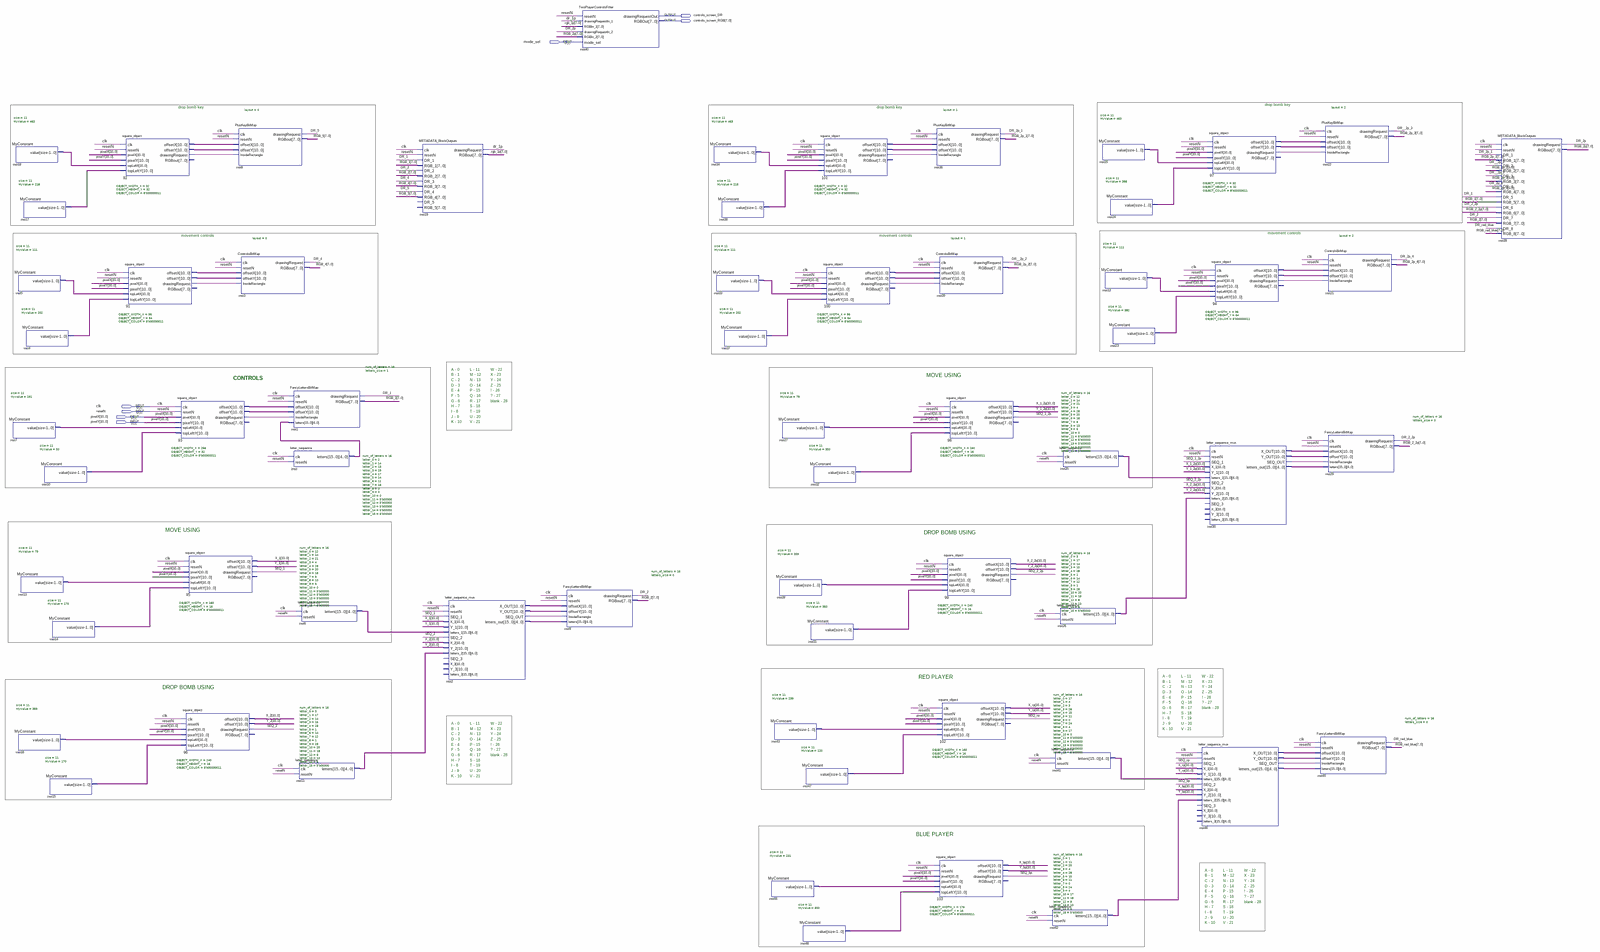
[diagram p0: schematic sheet, whole]
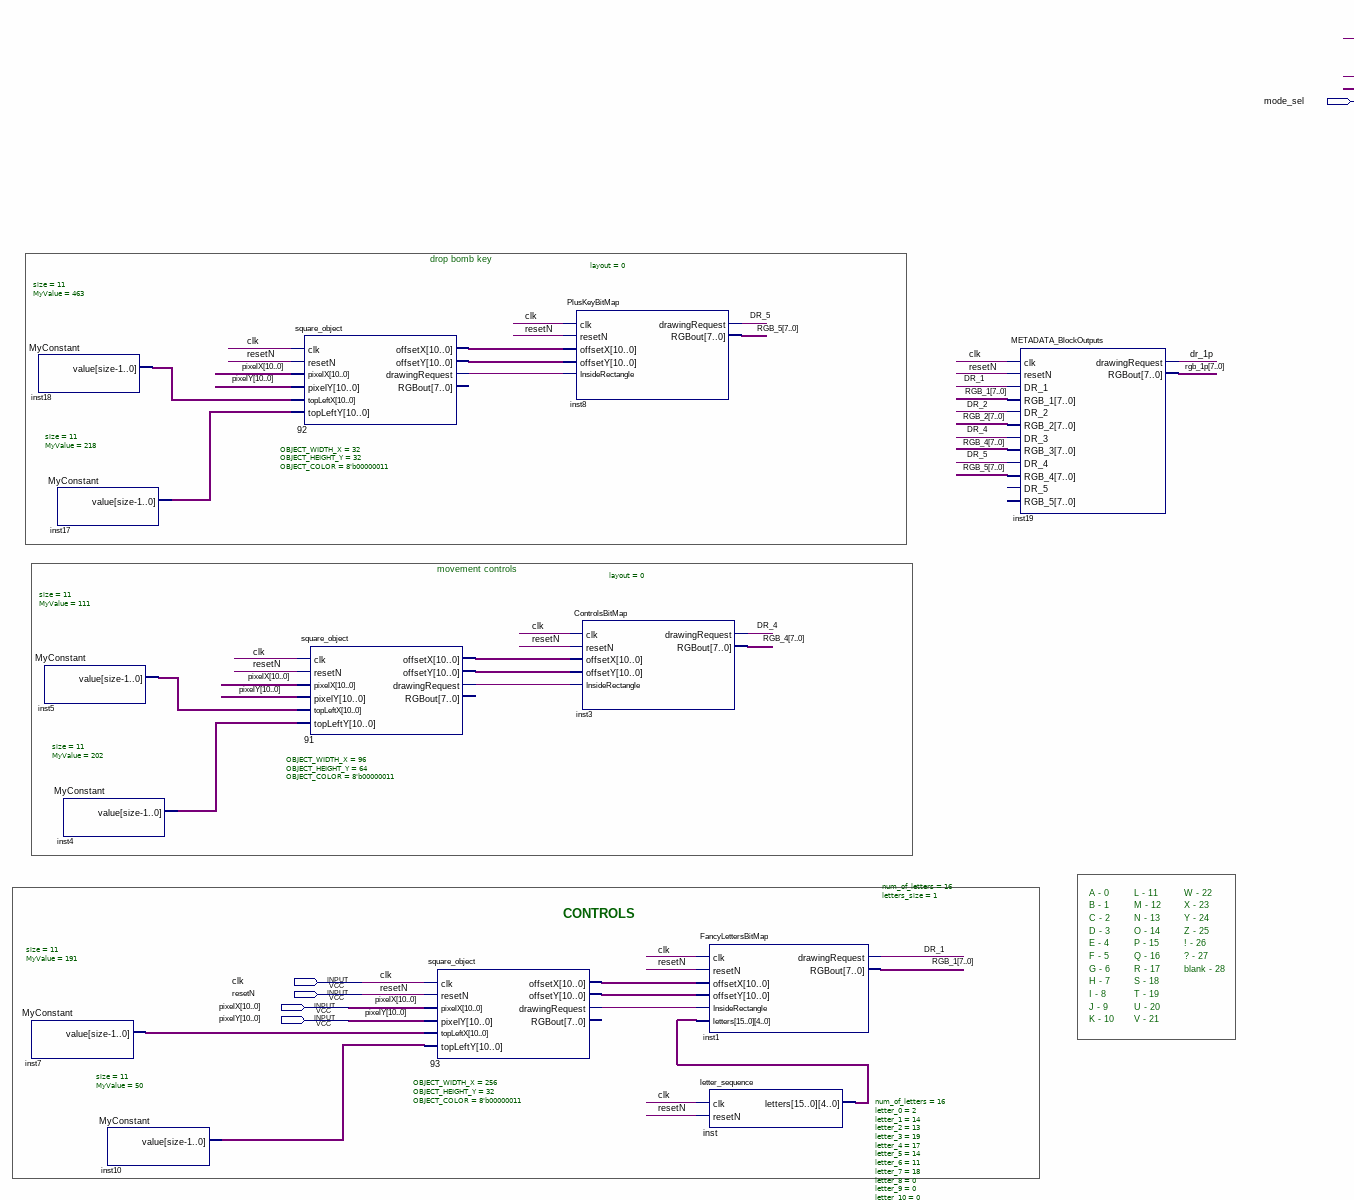
[diagram p1: schematic sheet, upper left part]
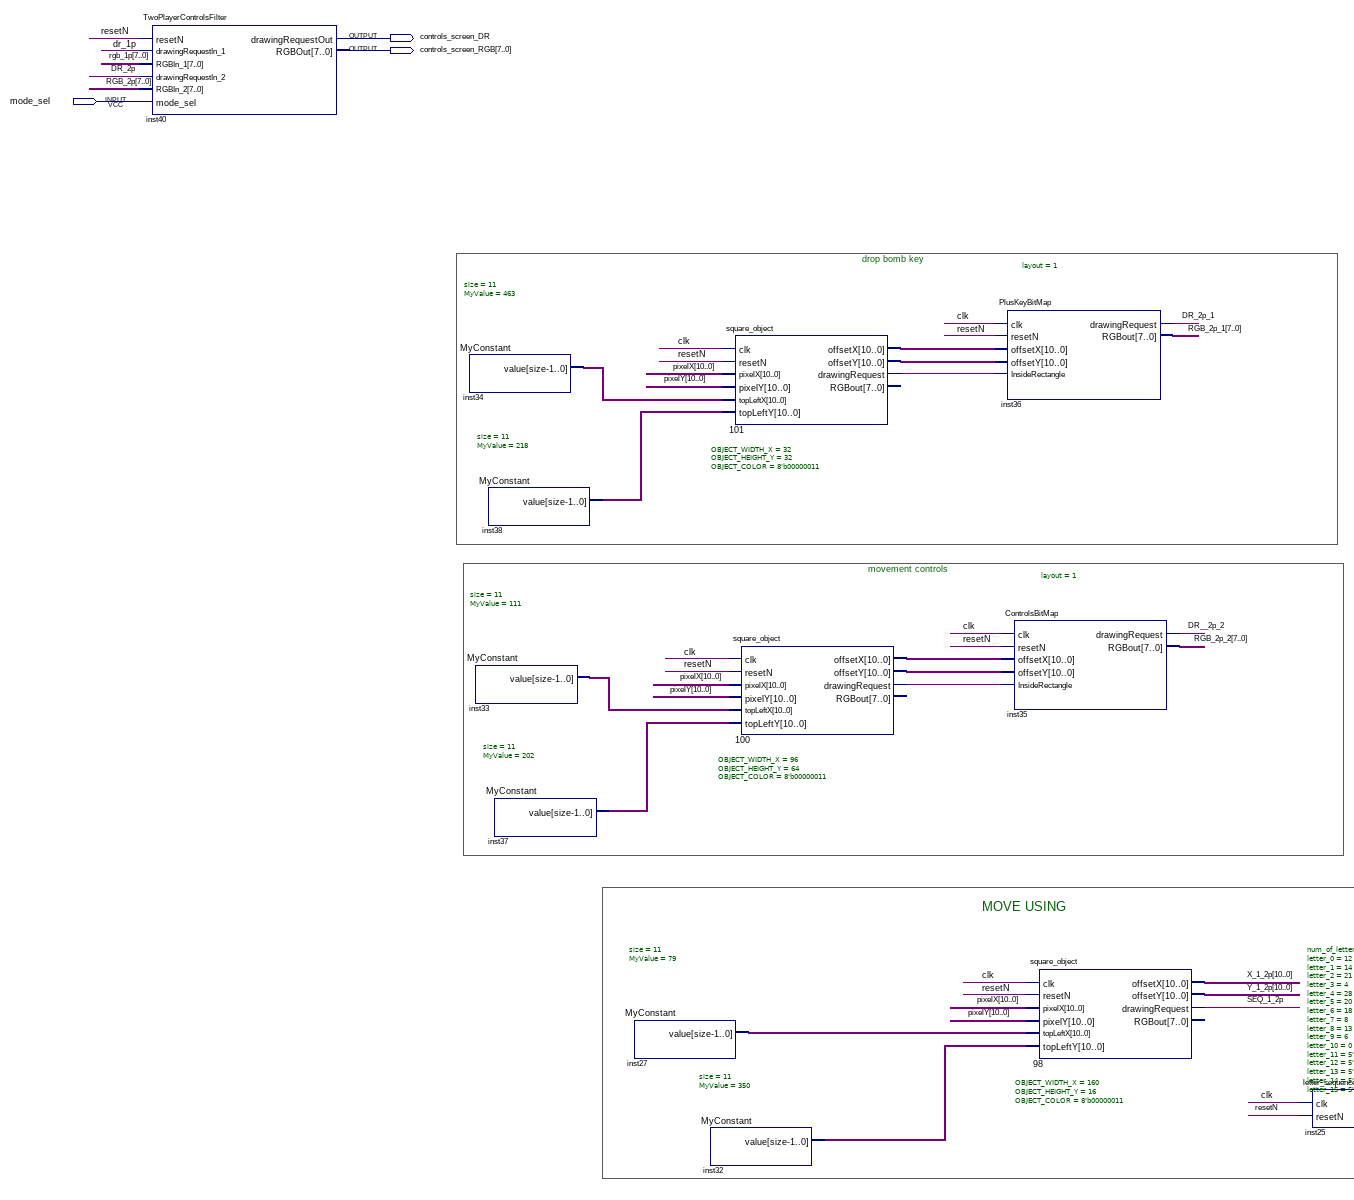
[diagram p2: schematic sheet, upper centre part]
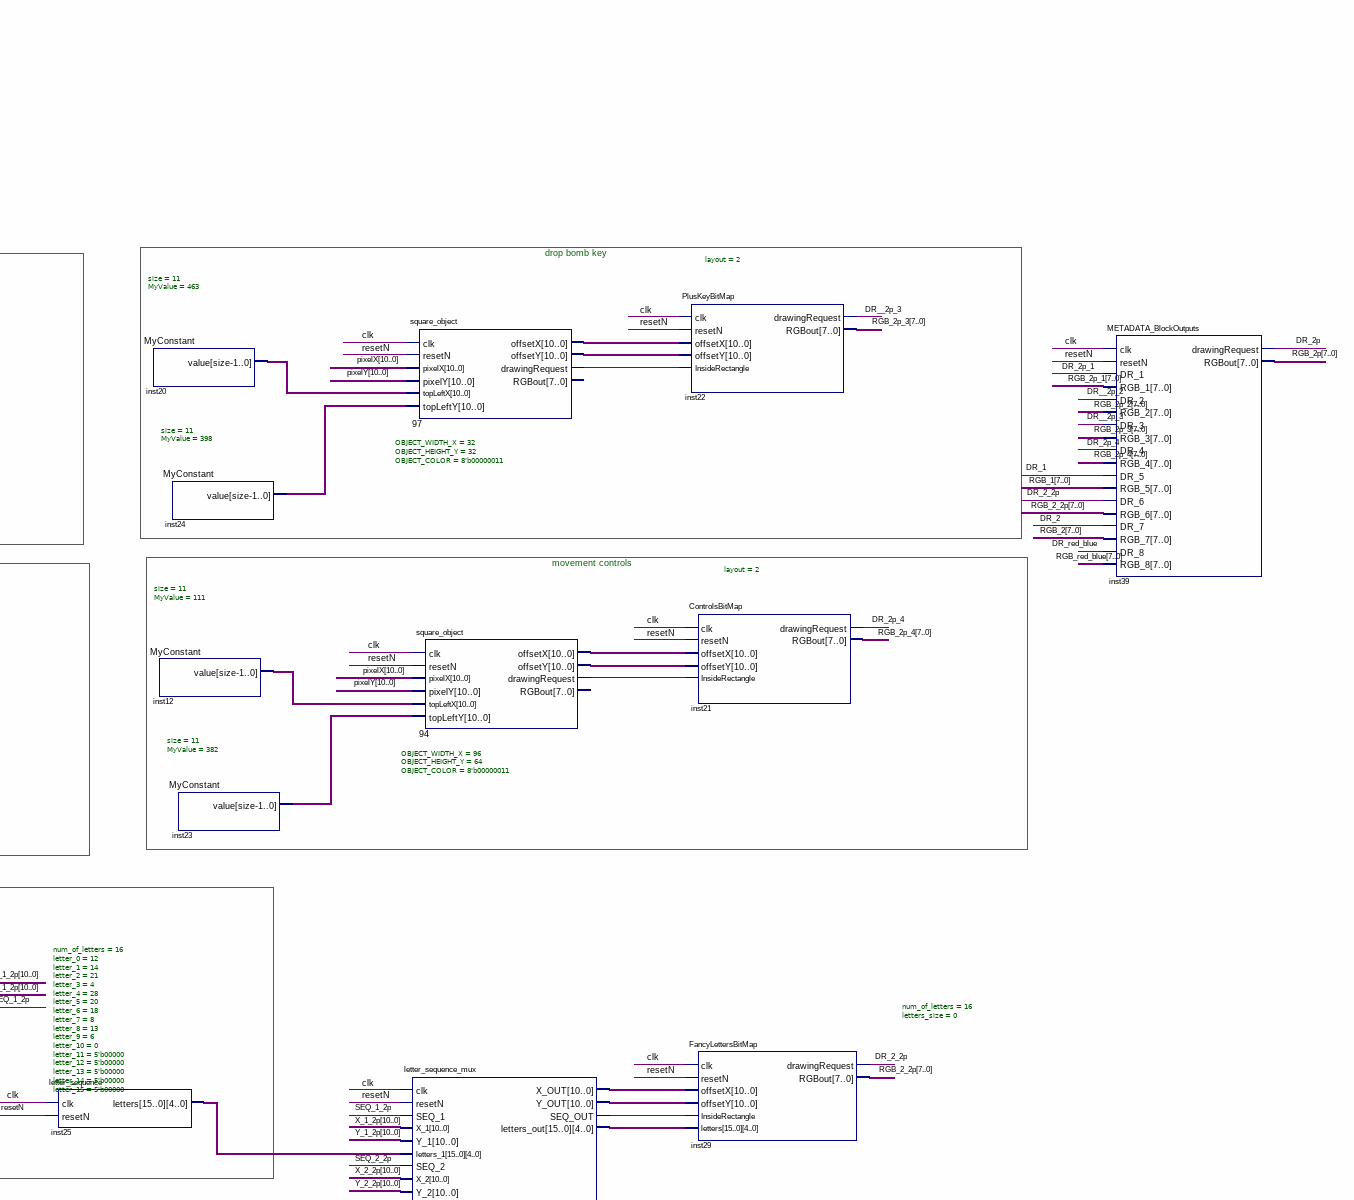
[diagram p3: schematic sheet, upper right part]
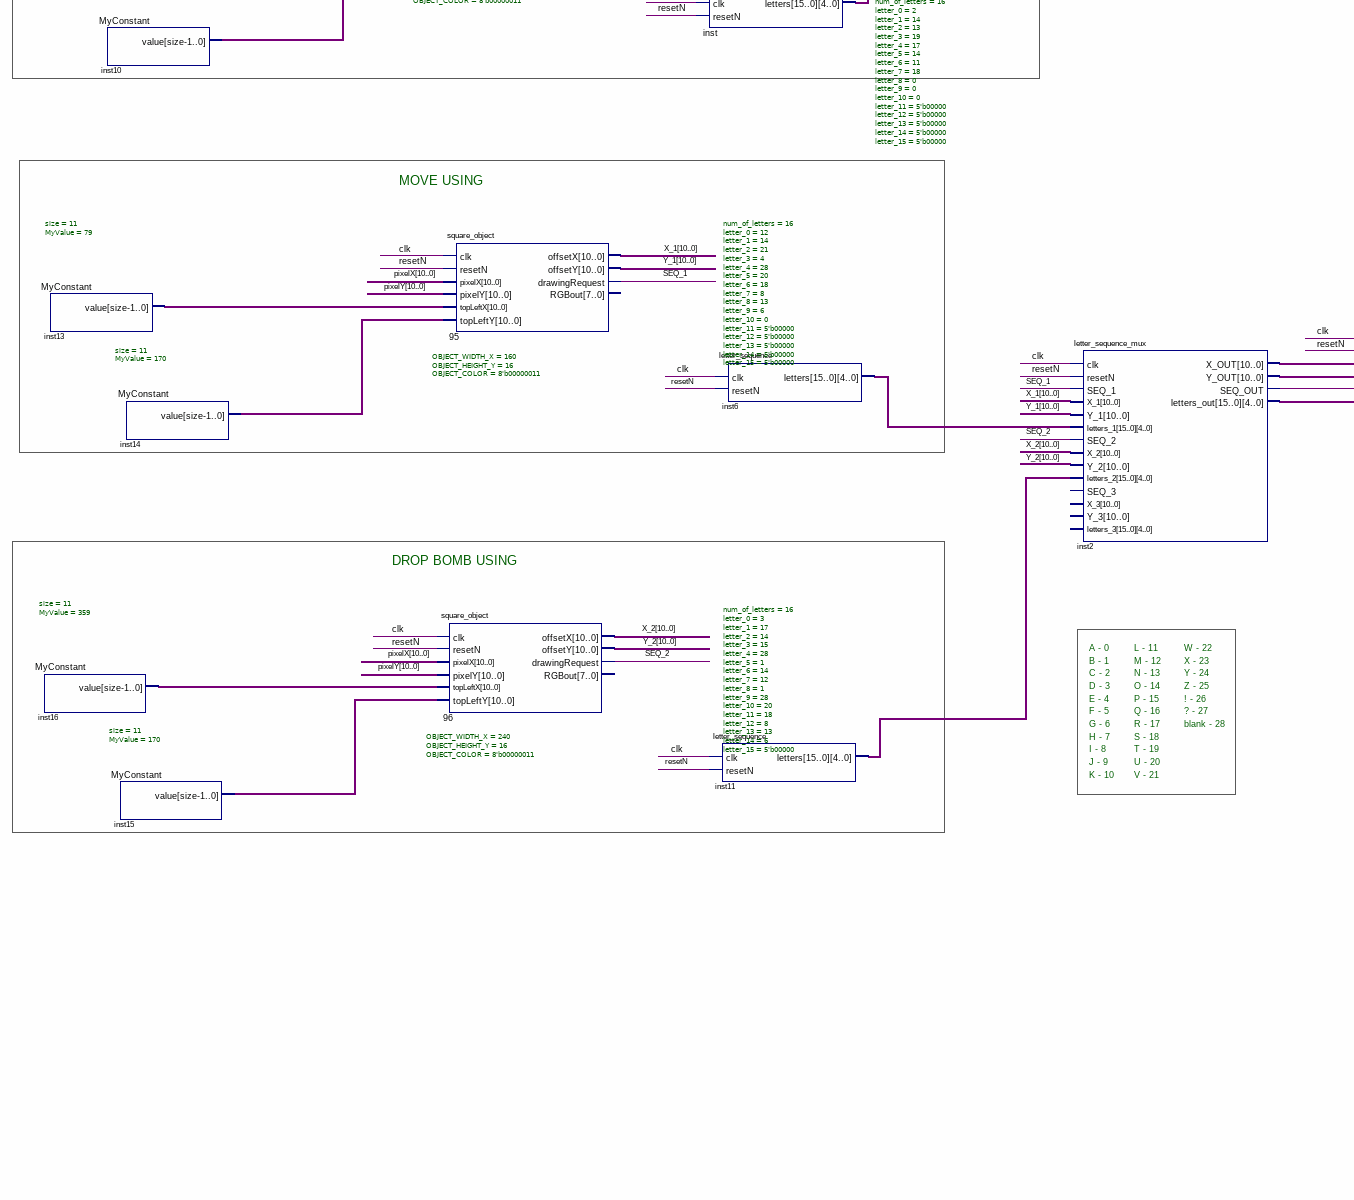
[diagram p4: schematic sheet, lower left part]
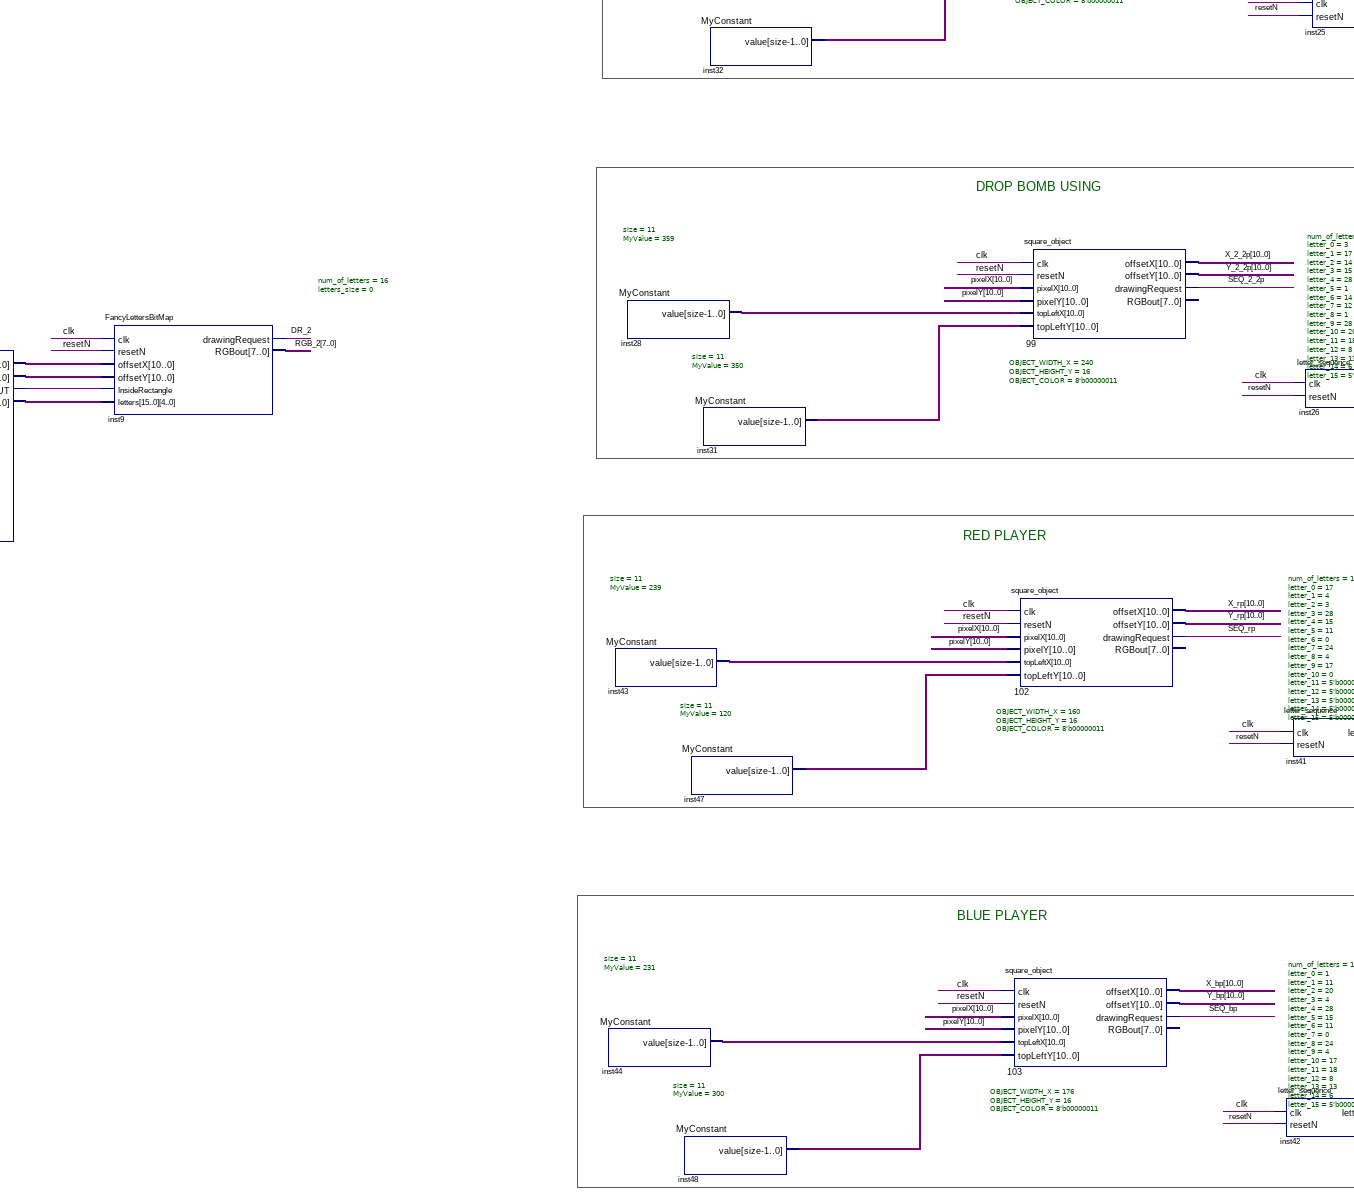
[diagram p5: schematic sheet, lower centre part]
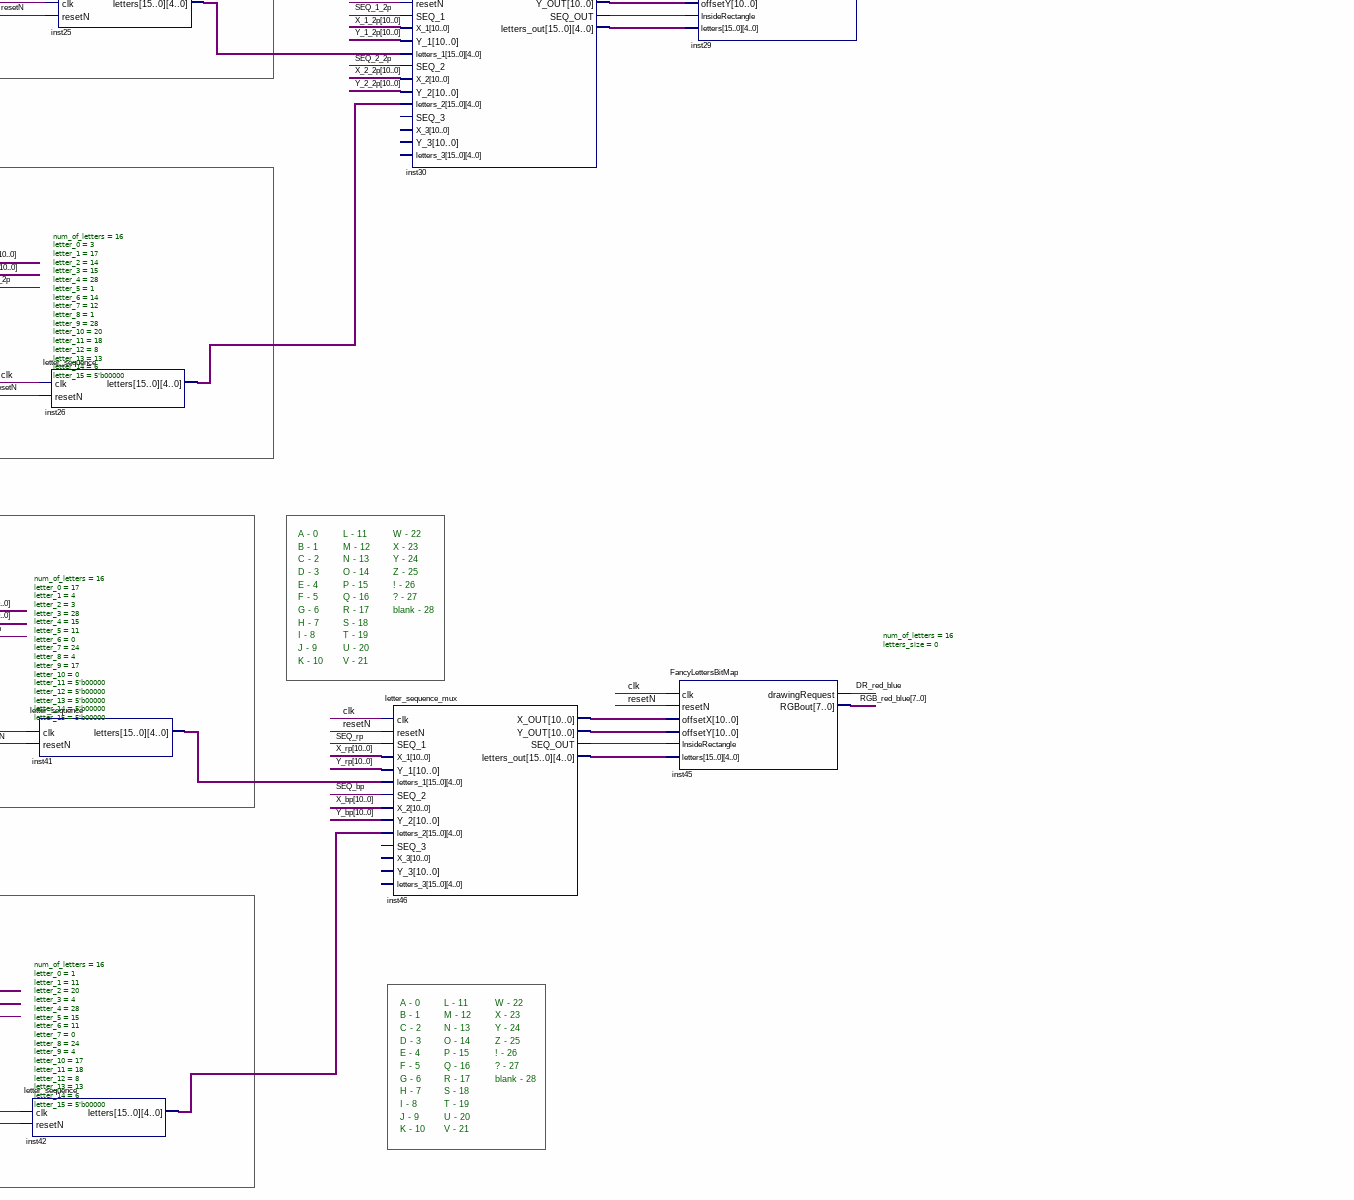
[diagram p6: schematic sheet, lower right part]
// Quartus schematic Controls_Screen_Block.bdf as structural Verilog: 62 symbols, 7 pins
module Controls_Screen_Block (
  input  mode_sel,
  input  clk,
  input  resetN,
  input  [10:0] pixelX,
  input  [10:0] pixelY,
  output controls_screen_DR,
  output [7:0] controls_screen_RGB
);

  wire DR_1, dr_1p, DR_2, DR_2_2p, DR_2p, DR_2p_1, DR_2p_4, DR_4, DR_5, DR__2p_2, DR__2p_3, DR_red_blue,
       inst2_seq_out, inst30_seq_out, inst46_seq_out, n91_drawingrequest, n92_drawingrequest,
       n93_drawingrequest, n94_drawingrequest, n97_drawingrequest, n100_drawingrequest, n101_drawingrequest,
       SEQ_1, SEQ_1_2p, SEQ_2, SEQ_2_2p, SEQ_bp, SEQ_rp;
  wire [7:0] RGB_1, rgb_1p, RGB_2, RGB_2_2p, RGB_2p, RGB_2p_1, RGB_2p_2, RGB_2p_3, RGB_2p_4, RGB_4, RGB_5,
       RGB_red_blue;
  wire [10:0] inst2_x_out, inst2_y_out, inst4_value, inst5_value, inst7_value, inst10_value, inst12_value,
       inst13_value, inst14_value, inst15_value, inst16_value, inst17_value, inst18_value, inst20_value,
       inst23_value, inst24_value, inst27_value, inst28_value, inst30_x_out, inst30_y_out, inst31_value,
       inst32_value, inst33_value, inst34_value, inst37_value, inst38_value, inst43_value, inst44_value,
       inst46_x_out, inst46_y_out, inst47_value, inst48_value, n91_offsetx, n91_offsety, n92_offsetx,
       n92_offsety, n93_offsetx, n93_offsety, n94_offsetx, n94_offsety, n97_offsetx, n97_offsety,
       n100_offsetx, n100_offsety, n101_offsetx, n101_offsety, X_1, X_1_2p, X_2, X_2_2p, X_bp, X_rp, Y_1,
       Y_1_2p, Y_2, Y_2_2p, Y_bp, Y_rp;
  wire [79:0] inst2_letters_out, inst6_letters, inst11_letters, inst25_letters, inst26_letters,
       inst30_letters_out, inst41_letters, inst42_letters, inst46_letters_out, inst_letters;

  MyConstant #(.size(11), .MyValue(463)) inst18 (.value(inst18_value));
  MyConstant #(.size(11), .MyValue(218)) inst17 (.value(inst17_value));
  MyConstant #(.size(11), .MyValue(111)) inst5 (.value(inst5_value));
  MyConstant #(.size(11), .MyValue(202)) inst4 (.value(inst4_value));
  MyConstant #(.size(11), .MyValue(191)) inst7 (.value(inst7_value));
  MyConstant #(.size(11), .MyValue(79)) inst13 (.value(inst13_value));
  MyConstant #(.size(11), .MyValue(359)) inst16 (.value(inst16_value));
  MyConstant #(.size(11), .MyValue(50)) inst10 (.value(inst10_value));
  MyConstant #(.size(11), .MyValue(170)) inst14 (.value(inst14_value));
  MyConstant #(.size(11), .MyValue(170)) inst15 (.value(inst15_value));
  square_object #(.OBJECT_WIDTH_X(32), .OBJECT_HEIGHT_Y(32), .OBJECT_COLOR(8'b00000011)) u_92 (
    .clk(clk), .resetN(resetN), .pixelX(pixelX), .pixelY(pixelY), .topLeftX(inst18_value),
    .topLeftY(inst17_value), .offsetX(n92_offsetx), .offsetY(n92_offsety), .drawingRequest(n92_drawingrequest));  // open: RGBout
  square_object #(.OBJECT_WIDTH_X(96), .OBJECT_HEIGHT_Y(64), .OBJECT_COLOR(8'b00000011)) u_91 (
    .clk(clk), .resetN(resetN), .pixelX(pixelX), .pixelY(pixelY), .topLeftX(inst5_value),
    .topLeftY(inst4_value), .offsetX(n91_offsetx), .offsetY(n91_offsety), .drawingRequest(n91_drawingrequest));  // open: RGBout
  square_object #(.OBJECT_WIDTH_X(256), .OBJECT_HEIGHT_Y(32), .OBJECT_COLOR(8'b00000011)) u_93 (
    .clk(clk), .resetN(resetN), .pixelX(pixelX), .pixelY(pixelY), .topLeftX(inst7_value),
    .topLeftY(inst10_value), .offsetX(n93_offsetx), .offsetY(n93_offsety), .drawingRequest(n93_drawingrequest));  // open: RGBout
  square_object #(.OBJECT_WIDTH_X(160), .OBJECT_HEIGHT_Y(16), .OBJECT_COLOR(8'b00000011)) u_95 (
    .clk(clk), .resetN(resetN), .pixelX(pixelX), .pixelY(pixelY), .topLeftX(inst13_value),
    .topLeftY(inst14_value), .offsetX(X_1), .offsetY(Y_1), .drawingRequest(SEQ_1));  // open: RGBout
  square_object #(.OBJECT_WIDTH_X(240), .OBJECT_HEIGHT_Y(16), .OBJECT_COLOR(8'b00000011)) u_96 (
    .clk(clk), .resetN(resetN), .pixelX(pixelX), .pixelY(pixelY), .topLeftX(inst16_value),
    .topLeftY(inst15_value), .offsetX(X_2), .offsetY(Y_2), .drawingRequest(SEQ_2));  // open: RGBout
  PlusKeyBitMap #(.layout(0)) inst8 (
    .clk(clk), .resetN(resetN), .offsetX(n92_offsetx), .offsetY(n92_offsety),
    .InsideRectangle(n92_drawingrequest), .drawingRequest(DR_5), .RGBout(RGB_5));
  ControlsBitMap #(.layout(0)) inst3 (
    .clk(clk), .resetN(resetN), .offsetX(n91_offsetx), .offsetY(n91_offsety),
    .InsideRectangle(n91_drawingrequest), .drawingRequest(DR_4), .RGBout(RGB_4));
  FancyLettersBitMap #(.num_of_letters(16), .letters_size(1)) inst1 (
    .clk(clk), .resetN(resetN), .offsetX(n93_offsetx), .offsetY(n93_offsety),
    .InsideRectangle(n93_drawingrequest), .letters(inst_letters), .drawingRequest(DR_1), .RGBout(RGB_1));
  letter_sequence #(.num_of_letters(16), .letter_0(2), .letter_1(14), .letter_2(13), .letter_3(19), .letter_4(17), .letter_5(14), .letter_6(11), .letter_7(18), .letter_8(0), .letter_9(0), .letter_10(0), .letter_11(5'b00000), .letter_12(5'b00000), .letter_13(5'b00000), .letter_14(5'b00000), .letter_15(5'b00000)) inst (
    .clk(clk), .resetN(resetN), .letters(inst_letters));
  letter_sequence #(.num_of_letters(16), .letter_0(3), .letter_1(17), .letter_2(14), .letter_3(15), .letter_4(28), .letter_5(1), .letter_6(14), .letter_7(12), .letter_8(1), .letter_9(28), .letter_10(20), .letter_11(18), .letter_12(8), .letter_13(13), .letter_14(6), .letter_15(5'b00000)) inst11 (
    .clk(clk), .resetN(resetN), .letters(inst11_letters));
  letter_sequence #(.num_of_letters(16), .letter_0(12), .letter_1(14), .letter_2(21), .letter_3(4), .letter_4(28), .letter_5(20), .letter_6(18), .letter_7(8), .letter_8(13), .letter_9(6), .letter_10(0), .letter_11(5'b00000), .letter_12(5'b00000), .letter_13(5'b00000), .letter_14(5'b00000), .letter_15(5'b00000)) inst6 (
    .clk(clk), .resetN(resetN), .letters(inst6_letters));
  METADATA_BlockOutputs inst19 (
    .clk(clk), .resetN(resetN), .DR_1(DR_1), .RGB_1(RGB_1), .DR_2(DR_2), .RGB_2(RGB_2), .DR_3(DR_4),
    .RGB_3(RGB_4), .DR_4(DR_5), .RGB_4(RGB_5), .drawingRequest(dr_1p), .RGBout(rgb_1p));  // open: DR_5, RGB_5
  letter_sequence_mux inst2 (
    .clk(clk), .resetN(resetN), .SEQ_1(SEQ_1), .X_1(X_1), .Y_1(Y_1), .letters_1(inst6_letters),
    .SEQ_2(SEQ_2), .X_2(X_2), .Y_2(Y_2), .letters_2(inst11_letters), .X_OUT(inst2_x_out),
    .Y_OUT(inst2_y_out), .SEQ_OUT(inst2_seq_out), .letters_out(inst2_letters_out));  // open: SEQ_3, X_3, Y_3, letters_3
  FancyLettersBitMap #(.num_of_letters(16), .letters_size(0)) inst9 (
    .clk(clk), .resetN(resetN), .offsetX(inst2_x_out), .offsetY(inst2_y_out),
    .InsideRectangle(inst2_seq_out), .letters(inst2_letters_out), .drawingRequest(DR_2), .RGBout(RGB_2));
  TwoPlayerControlsFilter inst40 (
    .resetN(resetN), .drawingRequestIn_1(dr_1p), .RGBIn_1(rgb_1p), .drawingRequestIn_2(DR_2p),
    .RGBIn_2(RGB_2p), .mode_sel(mode_sel), .drawingRequestOut(controls_screen_DR),
    .RGBOut(controls_screen_RGB));
  MyConstant #(.size(11), .MyValue(463)) inst34 (.value(inst34_value));
  MyConstant #(.size(11), .MyValue(111)) inst33 (.value(inst33_value));
  MyConstant #(.size(11), .MyValue(218)) inst38 (.value(inst38_value));
  MyConstant #(.size(11), .MyValue(202)) inst37 (.value(inst37_value));
  MyConstant #(.size(11), .MyValue(79)) inst27 (.value(inst27_value));
  MyConstant #(.size(11), .MyValue(359)) inst28 (.value(inst28_value));
  MyConstant #(.size(11), .MyValue(239)) inst43 (.value(inst43_value));
  MyConstant #(.size(11), .MyValue(231)) inst44 (.value(inst44_value));
  MyConstant #(.size(11), .MyValue(300)) inst48 (.value(inst48_value));
  square_object #(.OBJECT_WIDTH_X(32), .OBJECT_HEIGHT_Y(32), .OBJECT_COLOR(8'b00000011)) u_101 (
    .clk(clk), .resetN(resetN), .pixelX(pixelX), .pixelY(pixelY), .topLeftX(inst34_value),
    .topLeftY(inst38_value), .offsetX(n101_offsetx), .offsetY(n101_offsety),
    .drawingRequest(n101_drawingrequest));  // open: RGBout
  MyConstant #(.size(11), .MyValue(350)) inst32 (.value(inst32_value));
  MyConstant #(.size(11), .MyValue(350)) inst31 (.value(inst31_value));
  MyConstant #(.size(11), .MyValue(120)) inst47 (.value(inst47_value));
  square_object #(.OBJECT_WIDTH_X(96), .OBJECT_HEIGHT_Y(64), .OBJECT_COLOR(8'b00000011)) u_100 (
    .clk(clk), .resetN(resetN), .pixelX(pixelX), .pixelY(pixelY), .topLeftX(inst33_value),
    .topLeftY(inst37_value), .offsetX(n100_offsetx), .offsetY(n100_offsety),
    .drawingRequest(n100_drawingrequest));  // open: RGBout
  PlusKeyBitMap #(.layout(1)) inst36 (
    .clk(clk), .resetN(resetN), .offsetX(n101_offsetx), .offsetY(n101_offsety),
    .InsideRectangle(n101_drawingrequest), .drawingRequest(DR_2p_1), .RGBout(RGB_2p_1));
  ControlsBitMap #(.layout(1)) inst35 (
    .clk(clk), .resetN(resetN), .offsetX(n100_offsetx), .offsetY(n100_offsety),
    .InsideRectangle(n100_drawingrequest), .drawingRequest(DR__2p_2), .RGBout(RGB_2p_2));
  square_object #(.OBJECT_WIDTH_X(160), .OBJECT_HEIGHT_Y(16), .OBJECT_COLOR(8'b00000011)) u_98 (
    .clk(clk), .resetN(resetN), .pixelX(pixelX), .pixelY(pixelY), .topLeftX(inst27_value),
    .topLeftY(inst32_value), .offsetX(X_1_2p), .offsetY(Y_1_2p), .drawingRequest(SEQ_1_2p));  // open: RGBout
  square_object #(.OBJECT_WIDTH_X(240), .OBJECT_HEIGHT_Y(16), .OBJECT_COLOR(8'b00000011)) u_99 (
    .clk(clk), .resetN(resetN), .pixelX(pixelX), .pixelY(pixelY), .topLeftX(inst28_value),
    .topLeftY(inst31_value), .offsetX(X_2_2p), .offsetY(Y_2_2p), .drawingRequest(SEQ_2_2p));  // open: RGBout
  square_object #(.OBJECT_WIDTH_X(160), .OBJECT_HEIGHT_Y(16), .OBJECT_COLOR(8'b00000011)) u_102 (
    .clk(clk), .resetN(resetN), .pixelX(pixelX), .pixelY(pixelY), .topLeftX(inst43_value),
    .topLeftY(inst47_value), .offsetX(X_rp), .offsetY(Y_rp), .drawingRequest(SEQ_rp));  // open: RGBout
  square_object #(.OBJECT_WIDTH_X(176), .OBJECT_HEIGHT_Y(16), .OBJECT_COLOR(8'b00000011)) u_103 (
    .clk(clk), .resetN(resetN), .pixelX(pixelX), .pixelY(pixelY), .topLeftX(inst44_value),
    .topLeftY(inst48_value), .offsetX(X_bp), .offsetY(Y_bp), .drawingRequest(SEQ_bp));  // open: RGBout
  letter_sequence #(.num_of_letters(16), .letter_0(17), .letter_1(4), .letter_2(3), .letter_3(28), .letter_4(15), .letter_5(11), .letter_6(0), .letter_7(24), .letter_8(4), .letter_9(17), .letter_10(0), .letter_11(5'b00000), .letter_12(5'b00000), .letter_13(5'b00000), .letter_14(5'b00000), .letter_15(5'b00000)) inst41 (
    .clk(clk), .resetN(resetN), .letters(inst41_letters));
  letter_sequence #(.num_of_letters(16), .letter_0(1), .letter_1(11), .letter_2(20), .letter_3(4), .letter_4(28), .letter_5(15), .letter_6(11), .letter_7(0), .letter_8(24), .letter_9(4), .letter_10(17), .letter_11(18), .letter_12(8), .letter_13(13), .letter_14(6), .letter_15(5'b00000)) inst42 (
    .clk(clk), .resetN(resetN), .letters(inst42_letters));
  letter_sequence #(.num_of_letters(16), .letter_0(12), .letter_1(14), .letter_2(21), .letter_3(4), .letter_4(28), .letter_5(20), .letter_6(18), .letter_7(8), .letter_8(13), .letter_9(6), .letter_10(0), .letter_11(5'b00000), .letter_12(5'b00000), .letter_13(5'b00000), .letter_14(5'b00000), .letter_15(5'b00000)) inst25 (
    .clk(clk), .resetN(resetN), .letters(inst25_letters));
  letter_sequence #(.num_of_letters(16), .letter_0(3), .letter_1(17), .letter_2(14), .letter_3(15), .letter_4(28), .letter_5(1), .letter_6(14), .letter_7(12), .letter_8(1), .letter_9(28), .letter_10(20), .letter_11(18), .letter_12(8), .letter_13(13), .letter_14(6), .letter_15(5'b00000)) inst26 (
    .clk(clk), .resetN(resetN), .letters(inst26_letters));
  MyConstant #(.size(11), .MyValue(463)) inst20 (.value(inst20_value));
  MyConstant #(.size(11), .MyValue(398)) inst24 (.value(inst24_value));
  MyConstant #(.size(11), .MyValue(111)) inst12 (.value(inst12_value));
  MyConstant #(.size(11), .MyValue(382)) inst23 (.value(inst23_value));
  letter_sequence_mux inst46 (
    .clk(clk), .resetN(resetN), .SEQ_1(SEQ_rp), .X_1(X_rp), .Y_1(Y_rp), .letters_1(inst41_letters),
    .SEQ_2(SEQ_bp), .X_2(X_bp), .Y_2(Y_bp), .letters_2(inst42_letters), .X_OUT(inst46_x_out),
    .Y_OUT(inst46_y_out), .SEQ_OUT(inst46_seq_out), .letters_out(inst46_letters_out));  // open: SEQ_3, X_3, Y_3, letters_3
  square_object #(.OBJECT_WIDTH_X(32), .OBJECT_HEIGHT_Y(32), .OBJECT_COLOR(8'b00000011)) u_97 (
    .clk(clk), .resetN(resetN), .pixelX(pixelX), .pixelY(pixelY), .topLeftX(inst20_value),
    .topLeftY(inst24_value), .offsetX(n97_offsetx), .offsetY(n97_offsety), .drawingRequest(n97_drawingrequest));  // open: RGBout
  square_object #(.OBJECT_WIDTH_X(96), .OBJECT_HEIGHT_Y(64), .OBJECT_COLOR(8'b00000011)) u_94 (
    .clk(clk), .resetN(resetN), .pixelX(pixelX), .pixelY(pixelY), .topLeftX(inst12_value),
    .topLeftY(inst23_value), .offsetX(n94_offsetx), .offsetY(n94_offsety), .drawingRequest(n94_drawingrequest));  // open: RGBout
  letter_sequence_mux inst30 (
    .clk(clk), .resetN(resetN), .SEQ_1(SEQ_1_2p), .X_1(X_1_2p), .Y_1(Y_1_2p), .letters_1(inst25_letters),
    .SEQ_2(SEQ_2_2p), .X_2(X_2_2p), .Y_2(Y_2_2p), .letters_2(inst26_letters), .X_OUT(inst30_x_out),
    .Y_OUT(inst30_y_out), .SEQ_OUT(inst30_seq_out), .letters_out(inst30_letters_out));  // open: SEQ_3, X_3, Y_3, letters_3
  PlusKeyBitMap #(.layout(2)) inst22 (
    .clk(clk), .resetN(resetN), .offsetX(n97_offsetx), .offsetY(n97_offsety),
    .InsideRectangle(n97_drawingrequest), .drawingRequest(DR__2p_3), .RGBout(RGB_2p_3));
  ControlsBitMap #(.layout(2)) inst21 (
    .clk(clk), .resetN(resetN), .offsetX(n94_offsetx), .offsetY(n94_offsety),
    .InsideRectangle(n94_drawingrequest), .drawingRequest(DR_2p_4), .RGBout(RGB_2p_4));
  FancyLettersBitMap #(.num_of_letters(16), .letters_size(0)) inst29 (
    .clk(clk), .resetN(resetN), .offsetX(inst30_x_out), .offsetY(inst30_y_out),
    .InsideRectangle(inst30_seq_out), .letters(inst30_letters_out), .drawingRequest(DR_2_2p),
    .RGBout(RGB_2_2p));
  FancyLettersBitMap #(.num_of_letters(16), .letters_size(0)) inst45 (
    .clk(clk), .resetN(resetN), .offsetX(inst46_x_out), .offsetY(inst46_y_out),
    .InsideRectangle(inst46_seq_out), .letters(inst46_letters_out), .drawingRequest(DR_red_blue),
    .RGBout(RGB_red_blue));
  METADATA_BlockOutputs inst39 (
    .clk(clk), .resetN(resetN), .DR_1(DR_2p_1), .RGB_1(RGB_2p_1), .DR_2(DR__2p_2), .RGB_2(RGB_2p_2),
    .DR_3(DR__2p_3), .RGB_3(RGB_2p_3), .DR_4(DR_2p_4), .RGB_4(RGB_2p_4), .DR_5(DR_1), .RGB_5(RGB_1),
    .DR_6(DR_2_2p), .RGB_6(RGB_2_2p), .DR_7(DR_2), .RGB_7(RGB_2), .DR_8(DR_red_blue), .RGB_8(RGB_red_blue),
    .drawingRequest(DR_2p), .RGBout(RGB_2p));

  // Notes on the sheet:
  //   drop bomb key
  //   drop bomb key
  //   drop bomb key
  //   movement controls
  //   movement controls
  //   movement controls
  //   A - 0
  //   L - 11
  //   W - 22
  //   B - 1
  //   M - 12
  //   X - 23
  //   MOVE USING
  //   CONTROLS
  //   C - 2
  //   N - 13
  //   Y - 24
  //   D - 3
  //   O - 14
  //   Z - 25
  //   E - 4
  //   P - 15
  //   ! - 26
  //   F - 5
  //   Q - 16
  //   ? - 27
  //   G - 6
  //   R - 17
  //   blank - 28
  //   H - 7
  //   S - 18
  //   I - 8
  //   T - 19
  //   J - 9
  //   U - 20
  //   K - 10
  //   V - 21
  //   MOVE USING
  //   DROP BOMB USING
  //   RED PLAYER
  //   A - 0
  //   L - 11
  //   W - 22
  //   B - 1
  //   M - 12
  //   X - 23
  //   DROP BOMB USING
  //   C - 2
  //   N - 13
  //   Y - 24
  //   D - 3
  //   O - 14
  //   Z - 25
  //   E - 4
  //   P - 15
  //   ! - 26
  //   F - 5
  //   Q - 16
  //   ? - 27
  //   G - 6
  //   R - 17
  //   blank - 28
  //   H - 7
  //   S - 18
  //   I - 8
  //   T - 19
  //   A - 0
  //   L - 11
  //   W - 22
  //   J - 9
  //   U - 20
  //   B - 1
  //   M - 12
  //   X - 23
  //   K - 10
  //   V - 21
  //   C - 2
  //   N - 13
  //   Y - 24
  //   D - 3
  //   O - 14
  //   Z - 25
  //   E - 4
  //   P - 15
  //   ! - 26
  //   F - 5
  //   Q - 16
  //   ? - 27
  //   G - 6
  //   R - 17
  //   blank - 28
  //   H - 7
  //   S - 18
  //   I - 8
  //   T - 19
  //   J - 9
  //   U - 20
  //   K - 10
  //   V - 21
  //   BLUE PLAYER
  //   A - 0
  //   L - 11
  //   W - 22
  //   B - 1
  //   M - 12
  //   X - 23
  //   C - 2
  //   N - 13
  //   Y - 24
  //   D - 3
  //   O - 14
  //   Z - 25
  //   E - 4
  //   P - 15
  //   ! - 26
  //   F - 5
  //   Q - 16
  //   ? - 27
  //   G - 6
  //   R - 17
  //   blank - 28
  //   H - 7
  //   S - 18
  //   I - 8
  //   T - 19
  //   J - 9
  //   U - 20
  //   K - 10
  //   V - 21
endmodule
